# Altium schematic sheet logRTC.SchDoc
size A4
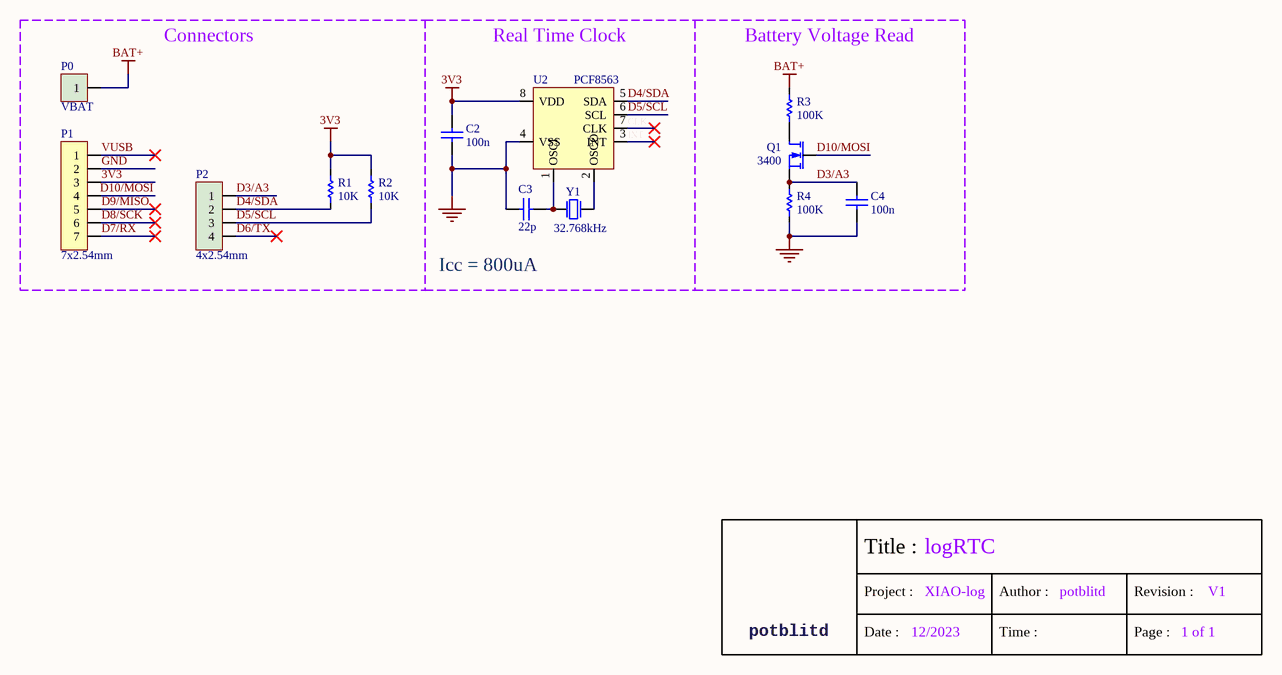
[diagram p0: logRTC.SchDoc]

## Parts
C2  value 100n  [0603CM]  (hidden comment: Capacitor)
C3  value 22p  [0603CM]  (hidden comment: Capacitor)
C4  value 100n  [0603CM]  (hidden comment: Capacitor)
P0  VBAT  [XIAO-BATCON]
P1  7x2.54mm  [7P-2.54mm-EDGE]
P2  4x2.54mm  [4P-2.54mm-EDGE]
Q1  3400  [SOT23-3 M]
R1  value 10K  [0603RM]  (hidden comment: Resistor)
R2  value 10K  [0603RM]  (hidden comment: Resistor)
R3  value 100K  [0603RM]  (hidden comment: Resistor)
R4  value 100K  [0603RM]  (hidden comment: Resistor)
U2  PCF8563  [SOP-8 M]
Y1  value 32.768kHz  [FC135 M]  (hidden comment: Oscillator)

## Nets
3V3: C2.1 P1.3 R1.2 R2.2 U2.8(VDD)
BAT+: P0.1 R3.2
GND: C2.2 C3.2 C4.2 P1.2 R4.1 U2.4(VSS)
CLK: U2.7(CLK)
D3/A3: C4.1 P2.1 Q1.2(S) R4.2
D4/SDA: P2.2 R1.1 U2.5(SDA)
D5/SCL: P2.3 R2.1 U2.6(SCL)
D6/TX: P2.4
D7/RX: P1.7
D8/SCK: P1.6
D9/MISO: P1.5
D10/MOSI: P1.4 Q1.1(G)
INT: U2.3(INT)
VUSB: P1.1
NetC3_1: C3.1 U2.1(OSCI) Y1.2
NetQ1_3: Q1.3(D) R3.1
NetU2_2: U2.2(OSCO) Y1.1

## Notes on the sheet
- Connectors
- Real Time Clock
- (near R3) Battery Voltage Read
- Icc = 800uA
- Title :
- logRTC
- potblitd
- Project :
- Date :
- 12/2023
- XIAO-log
- Author :
- Time :
- Revision :
- Page :
- 1 of 1
- V1

## Library data of the parts
C2 C4 = Capacitor: Capacitor 100nF ±10% 50V; Component: CC0603KRX7R9BB104; JLC Code: C14663
C3 = Capacitor: Capacitor 22pF ±5% 50V; Component: CL10C220JB8NNNC; JLC Code: C1653
P0 = 1-pin Header: BAT+ special pin
P1 = 7-pins Header: General 7-pin connection; Function: XIAO CON
P2 = 4-pins Header: General 4-pin connection
Q1 = MOSFET-N: MOSFET N-channel 30V 5.7A; Component: AO3400A; Function: VBAT-ADC enable; Value: N-FET; JLC Code: C20917
R1 = Resistor: Resistor 10kΩ ±1% 100mW; Component: 0603WAF1002T5E; Function: SDA pull-up; JLC Code: C25804
R2 = Resistor: Resistor 10kΩ ±1% 100mW; Component: 0603WAF1002T5E; Function: SCL pull-up; JLC Code: C25804
R3 R4 = Resistor: Resistor 100kΩ ±1% 100mW; Component: 0603WAF1003T5E; JLC Code: C25803
U2 = RTC-8563: IC real-time clock with alarm interrupt; Component: PCF8563T/5,518; Function: RTC; JLC Code: C7440
Y1 = XO-2: Crystal oscillator 32.768kHz 20ppm 12.5pF; Component: Q13FC1350000400; Function: RTC XO; JLC Code: C32346